# Altium schematic sheet Power.SchDoc
size A4; SheetNumber: 3; SheetTotal: 7
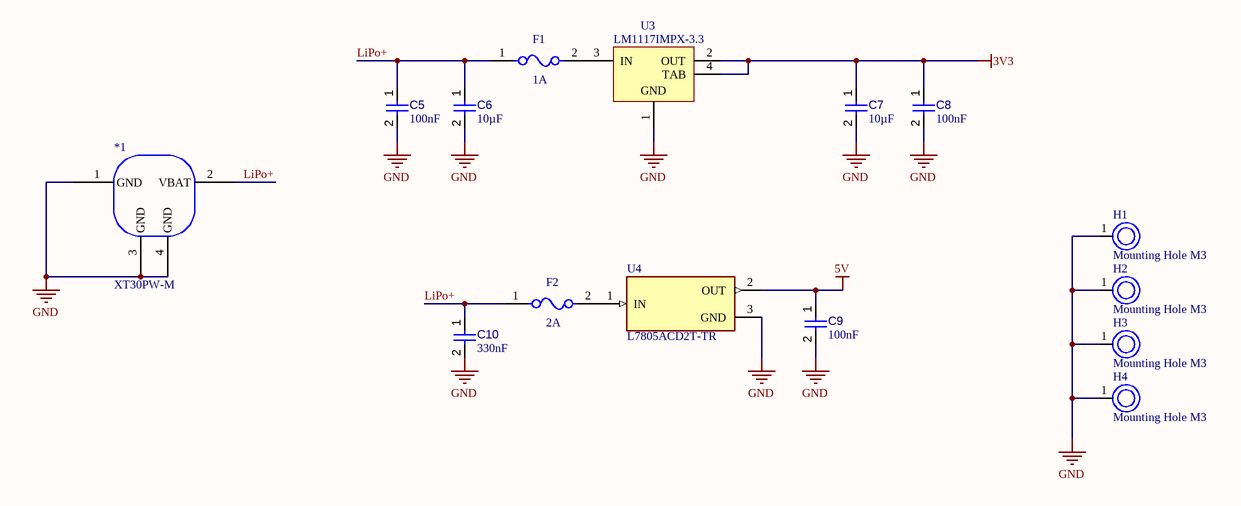
[diagram p0: Power.SchDoc]

## Parts
*1  XT30PW-M  [XT30PW-M-Footprint-1]
C5  value 100nF  [CAPC2013X95X50NL10T25]  (hidden comment: Capacitor 100 nF +/-10% 50 V 0805)
C6  value 10µF  [CAPC2013X135X45NL10T25]  (hidden comment: Capacitor 10 uF +/- 10% 16 V 0805)
C7  value 10µF  [CAPC2013X135X45NL10T25]  (hidden comment: Capacitor 10 uF +/- 10% 16 V 0805)
C8  value 100nF  [CAPC2013X95X50NL10T25]  (hidden comment: Capacitor 100 nF +/-10% 50 V 0805)
C9  value 100nF  [CAPC2013X135X45NL10T25]  (hidden comment: Capacitor 10 uF +/- 10% 16 V 0805)
C10  value 330nF  [CAPC2013X135X45NL10T25]  (hidden comment: Capacitor 10 uF +/- 10% 16 V 0805)
F1  1A  [FP-0466-MFG]
F2  2A  [FP-0466-MFG]
H1  Mounting Hole M3  [Mounting_Hole_m3]
H2  Mounting Hole M3  [Mounting_Hole_m3]
H3  Mounting Hole M3  [Mounting_Hole_m3]
H4  Mounting Hole M3  [Mounting_Hole_m3]
U3  LM1117IMPX-3.3  [MP04A_M]
U4  L7805ACD2T-TR  [TO254P1515X470-3N]

## Nets
3V3: C7.1 C8.1 U3.2(OUT) U3.4(TAB)
5V: C9.1 U4.2(OUT)
GND: *1.1(GND) *1.3(GND) *1.4(GND) C5.2 C6.2 C7.2 C8.2 C9.2 C10.2 H1.1 H2.1 H3.1 H4.1 U3.1(GND) U4.3(GND)
LiPo+: *1.2(VBAT) C5.1 C6.1 C10.1 F1.1 F2.1
NetF1_2: F1.2 U3.3(IN)
NetF2_2: F2.2 U4.1(IN)

## Notes on the sheet
- Author:
- Title:
- Sheet number:
- Modified:
- /
- Reviewers:
- Description:

## Library data of the parts
*1 = CMP-002-00073-3: XT30PW-M公头 Socket,DCsupply,XT30,male,PIN:2
C5 C8 = CMP-001-00018-6: Chip Capacitor, 100 nF, +/- 10%, 50 V, 0805 (2012 Metric); Capacitor Type: Ceramic; Voltage Rating: 50V; Pins: 2; Max Operating Temperature: 125°C; Min Operating Temperature: -55°C; Mounting Technology: SM; Case/Package: 0805; RoHS Compliant: True; Tolerance: 10%
C6 C7 C9 C10 = CMP-001-00015-6: Chip Capacitor, 10 uF, +/- 10%, 16 V, 0805 (2012 Metric); Voltage Rating: 16V; Capacitor Type: Ceramic; RoHS Compliant: True; Max Operating Temperature: 85°C; Min Operating Temperature: -55°C; Mounting Technology: SM; Tolerance: 10%; Case/Package: 0805; Pins: 2
F1 F2 = CMP-08605-000058-1: FUSE BOARD MNT 1A 63VAC/VDC 1206; Manufacturer Part Number: 0466001.NR; Manufacturer: Littelfuse Inc; Max Fuse Dc Voltage: 63V; Fuse Interrupt Ac Current: 50A; Fuse Voltage Drop: 79.97mV; Resistance: 0.075Ω; Value: 0.075Ω; Fuse I2T: 0.0423A2Sec; Fuse Blow Speed: Fast; Temperature Range High: +90°C; Max Fuse Ac Voltage: 63V; Package: 0466; ComponentLink2URL: https://www.littelfuse.com/~/media/electronics/datasheets/fuses/littelfuse_fuse_466_datasheet.pdf.pdf; Device Class L3: unset; Lead Free: Yes; Automotive: No; Digikey Description: FUSE BOARD MNT 1A 63VAC/VDC 1206; Height: 0.66mm; Temperature Range Low: -55°C; Category: Fuse; ComponentLink2Description: Datasheet; Device Class L1: Circuit Protection; Device Class L2: Fuses; Fuse Current: 1A; Mouser Description: Surface Mount Fuses 63V FA 1206 1A VFA Slimline; Octopart: https://octopart.com/0466001.nr-littelfuse-566005; Fuse Interrupt Dc Current: 50A; RoHS: TRUE; Voltage Rating: 63V; Temperature: -55°C to +90°C
H1-H4 = CMP-006-000018-1: M3; Design Item ID: Mounting Hole M3; Source: SamacSys.SchLib
U3 = CMP-0062-01630-3: 800mA Low-Dropout Linear Regulator, 4-pin SOT-223; Manufacturer: National Semiconductor; CompType: LDO IC; PowerWise: N; High-Reliability: Y; PackageTopMarking: XYTT*N05B; RoHS: N; Code_JEDEC: TO-261-AA; PackageVersion: revB, Apr-2003; ComponentLink3URL: http://www.national.com/pf/LM/LM1117.html; ComponentLink3Description: LM1117 Web Page; ComponentLink2URL: http://www.national.com/ds/LM/LM1117.pdf; Code_IPC: SOT223-4; DatasheetVersion: Apr-2006; ComponentLink4URL: http://www.national.com/packaging/folders/mp04a.html; ComponentLink2Description: LM1117 Datasheet; ComponentLink4Description: MP04A Package Page; PartNumber: LM1117IMPX-3.3; RevisionNote: SCH symbol layout adjusted; PackageReference: MP04A; PackageDescription: Molded SOT-223, 6.50 x 3.56 x 1.6mm Body, 4 Lead, 2.3mm Pitch; ComponentLink1Description: Manufacturer URL; ComponentLink1URL: http://www.national.com/; PinCount: 4
U4 = L7805ACD2T-TR: Positive voltage regulator ICs; MF: {'manufacturer': u'STMicroelectronics'}; Package: None; Price: None; Value: *; MP: L7805ACD2T-TR; Availability: Unavailable